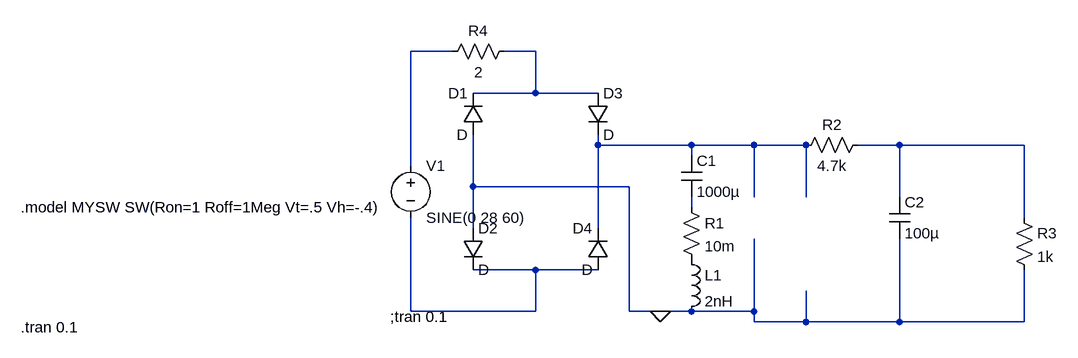
[diagram p0: schematic Power Supply.asc]
Power Supply.asc, the LTspice schematic file:
Version 4
SHEET 1 1680 680
WIRE 144 -80 80 -80
WIRE 272 -80 224 -80
WIRE 272 -16 272 -80
WIRE 272 -16 176 -16
WIRE 368 -16 272 -16
WIRE 368 64 368 48
WIRE 512 64 368 64
WIRE 608 64 512 64
WIRE 688 64 608 64
WIRE 832 64 768 64
WIRE 1024 64 832 64
WIRE 512 80 512 64
WIRE 80 96 80 -80
WIRE 176 128 176 48
WIRE 416 128 176 128
WIRE 608 144 608 64
WIRE 688 144 688 64
WIRE 832 144 832 64
WIRE 512 160 512 144
WIRE 1024 176 1024 64
WIRE 176 192 176 128
WIRE 368 192 368 64
WIRE 272 256 176 256
WIRE 368 256 272 256
WIRE 80 320 80 176
WIRE 272 320 272 256
WIRE 272 320 80 320
WIRE 416 320 416 128
WIRE 464 320 416 320
WIRE 512 320 464 320
WIRE 608 320 608 208
WIRE 608 320 512 320
WIRE 608 336 608 320
WIRE 688 336 688 288
WIRE 688 336 608 336
WIRE 832 336 832 208
WIRE 832 336 688 336
WIRE 1024 336 1024 256
WIRE 1024 336 832 336
FLAG 464 320 0
SYMBOL voltage 80 80 R0
WINDOW 123 0 0 Left 2
WINDOW 39 0 0 Left 2
SYMATTR InstName V1
SYMATTR Value SINE(0 28 60)
SYMBOL diode 192 48 R180
WINDOW 0 24 64 Left 2
WINDOW 3 24 0 Left 2
SYMATTR InstName D1
SYMBOL diode 160 192 R0
SYMATTR InstName D2
SYMBOL diode 352 -16 R0
SYMATTR InstName D3
SYMBOL diode 384 256 R180
WINDOW 0 24 64 Left 2
WINDOW 3 24 0 Left 2
SYMATTR InstName D4
SYMBOL cap 496 80 R0
SYMATTR InstName C1
SYMATTR Value 1000µ
SYMBOL res 496 144 R0
SYMATTR InstName R1
SYMATTR Value 10m
SYMBOL ind 496 224 R0
SYMATTR InstName L1
SYMATTR Value 2nH
SYMBOL res 240 -96 R90
WINDOW 0 0 56 VBottom 2
WINDOW 3 32 56 VTop 2
SYMATTR InstName R4
SYMATTR Value 2
SYMBOL res 784 48 R90
WINDOW 0 0 56 VBottom 2
WINDOW 3 32 56 VTop 2
SYMATTR InstName R2
SYMATTR Value 4.7k
SYMBOL cap 816 144 R0
SYMATTR InstName C2
SYMATTR Value 100µ
SYMBOL res 1008 160 R0
SYMATTR InstName R3
SYMATTR Value 1k
TEXT 48 328 Left 2 !;tran 0.1
TEXT -520 160 Left 2 !.model MYSW SW(Ron=1 Roff=1Meg Vt=.5 Vh=-.4)
TEXT -520 344 Left 2 !.tran 0.1

The netlist it stands for:
* Power Supply.asc
V1 N001 N006 SINE(0 28 60)
D1 0 N002 D
D2 0 N006 D
D3 N002 N003 D
D4 N006 N003 D
C1 N003 N005 1000µ
R1 N005 P001 10m
L1 P001 0 2nH
R4 N002 N001 2
R2 N004 N003 4.7k
C2 N004 0 100µ
R3 N004 0 1k
.model D D
.lib standard.dio
;tran 0.1
.model MYSW SW(Ron=1 Roff=1Meg Vt=.5 Vh=-.4)
.tran 0.1
.backanno
.end